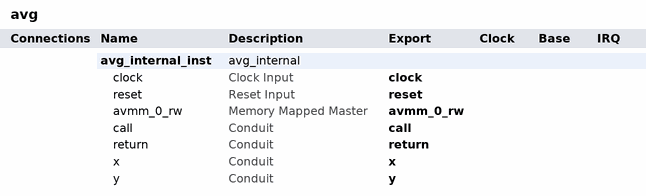
[diagram p0: system contents]
# Platform Designer (Qsys) system avg, Cyclone V 5CEFA9F23I7
# Parameters at their usual value, and those the tool derives, are not listed.
package require qsys
create_system avg
set_project_property DEVICE_FAMILY {Cyclone V}
set_project_property DEVICE 5CEFA9F23I7

add_instance avg_internal_inst avg_internal 1.0
set_instance_property avg_internal_inst AUTO_EXPORT true

# exported interfaces
add_interface avmm_0_rw avalon master
set_interface_property avmm_0_rw EXPORT_OF avg_internal_inst.avmm_0_rw
add_interface call conduit end
set_interface_property call EXPORT_OF avg_internal_inst.call
add_interface clock clock sink
set_interface_property clock EXPORT_OF avg_internal_inst.clock
add_interface reset reset sink
set_interface_property reset EXPORT_OF avg_internal_inst.reset
add_interface return conduit end
set_interface_property return EXPORT_OF avg_internal_inst.return
add_interface x conduit end
set_interface_property x EXPORT_OF avg_internal_inst.x
add_interface y conduit end
set_interface_property y EXPORT_OF avg_internal_inst.y

set_interconnect_requirement {$system} qsys_mm.clockCrossingAdapter HANDSHAKE
set_interconnect_requirement {$system} qsys_mm.enableEccProtection FALSE
set_interconnect_requirement {$system} qsys_mm.insertDefaultSlave FALSE
set_interconnect_requirement {$system} qsys_mm.maxAdditionalLatency 1

save_system avg.qsys
